# Altium schematic sheet SBG.SchDoc
size B; SheetNumber: 4; SheetTotal: 5
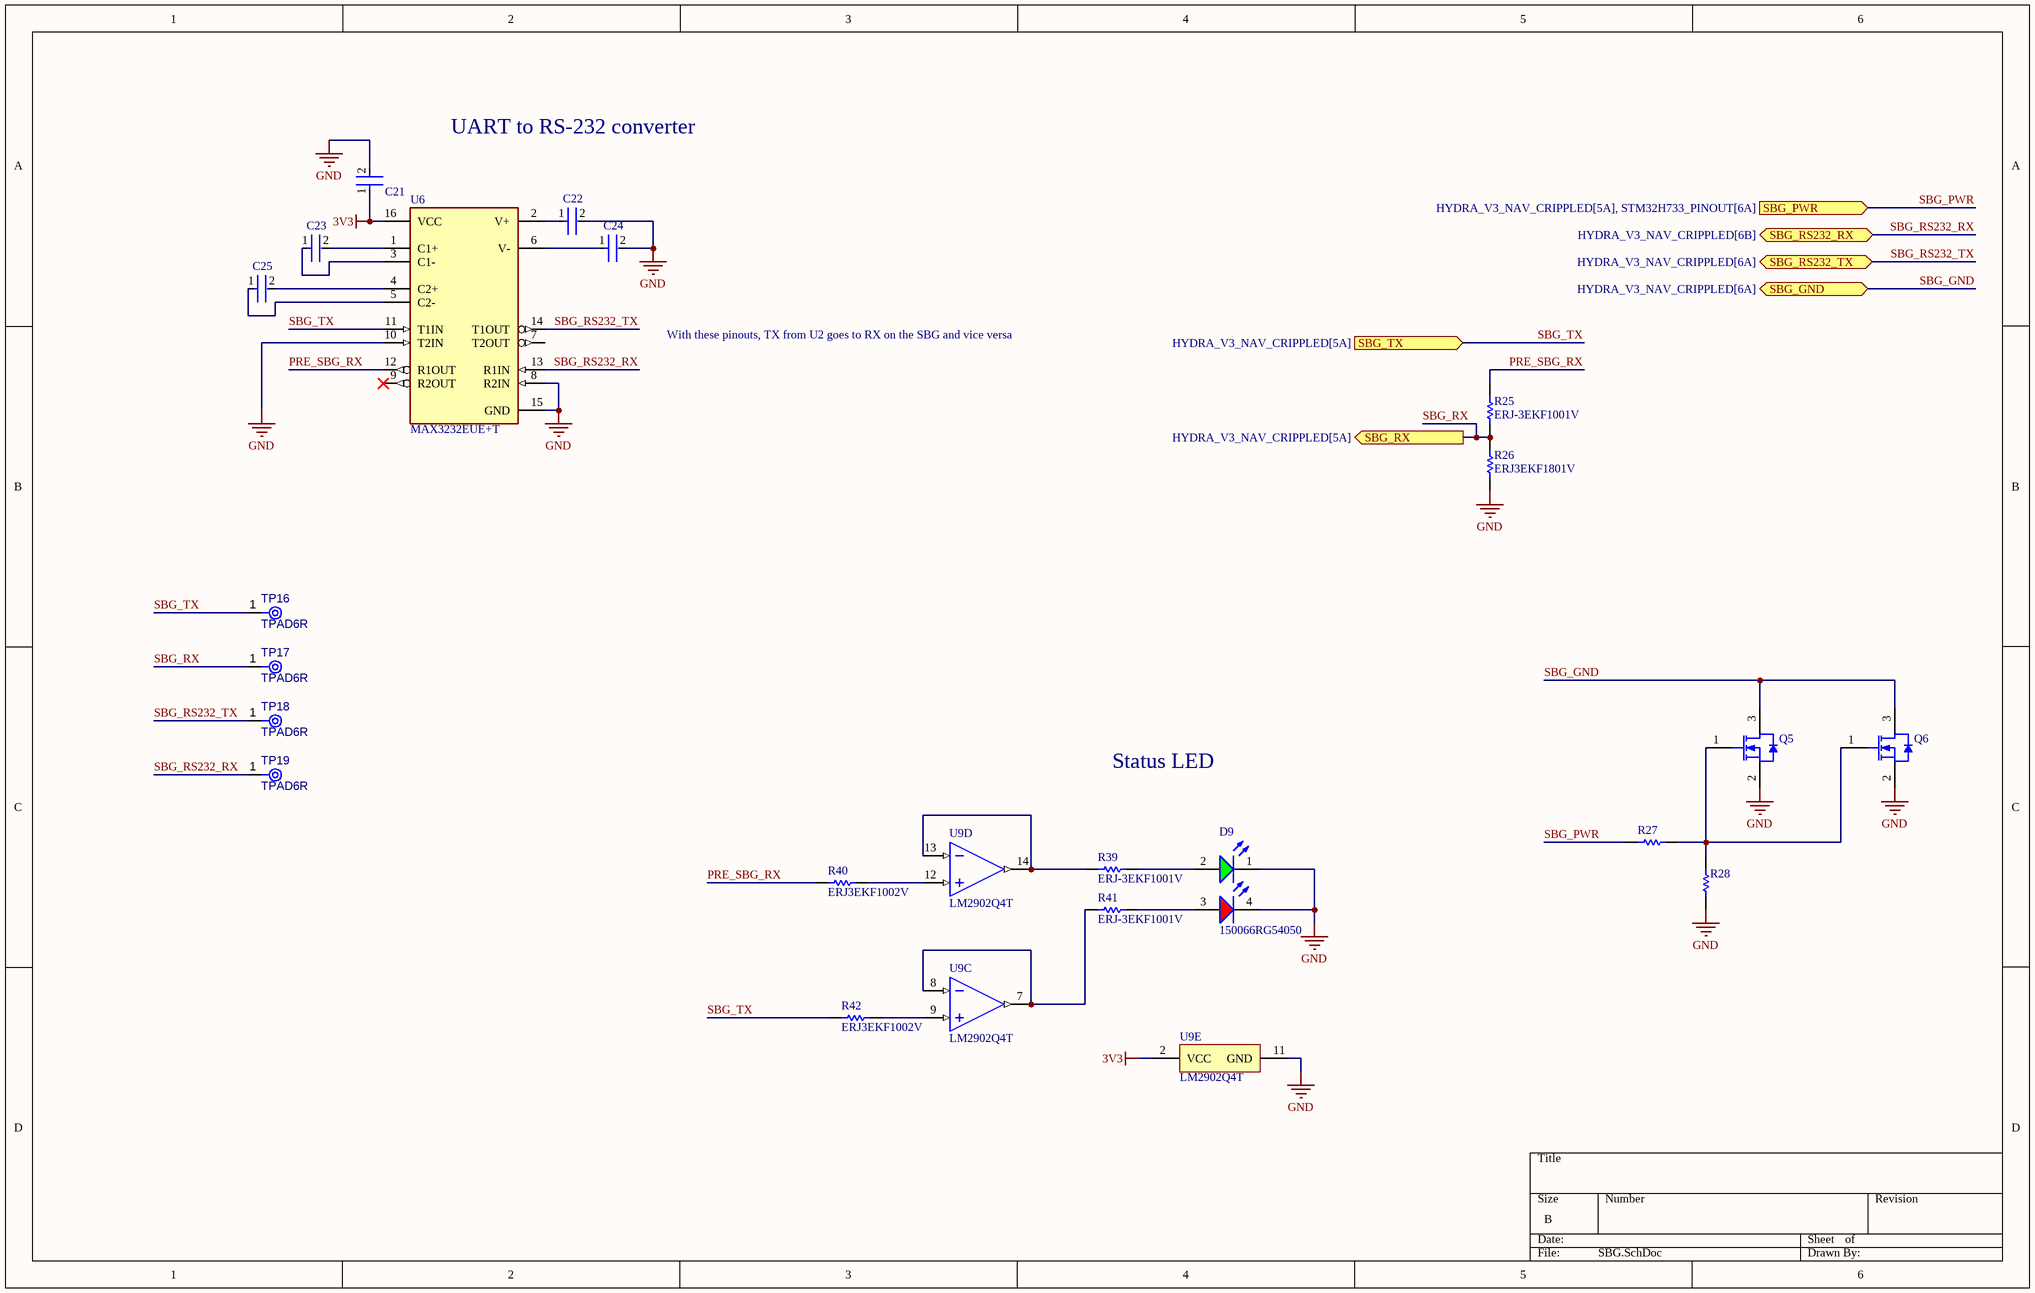
[diagram p0: SBG.SchDoc]

## Parts
C21  C0402C104K8PACTU  [FP-C0402-BB-MFG]  (value not drawn)
C22  C0603X104K5RACTU  [FP-C0603-CJ-MFG]  (value not drawn)
C23  C0603X104K5RACTU  [FP-C0603-CJ-MFG]  (value not drawn)
C24  C0603X104K5RACTU  [FP-C0603-CJ-MFG]  (value not drawn)
C25  C0603X104K5RACTU  [FP-C0603-CJ-MFG]  (value not drawn)
D9  150066RG54050  [WL-SBCD_0606]
Q5  BSS138W-7-F  [DIOD-SOT323-3_V]  (value not drawn)
Q6  BSS138W-7-F  [DIOD-SOT323-3_V]  (value not drawn)
R25  ERJ-3EKF1001V  [RESC1608X55X30LL15T15]
R26  ERJ3EKF1801V  [RESC1608X55X30LL15T15]
R27  ERJ-3EKF1001V  [RESC1608X55X30LL15T15]  (value not drawn)
R28  ERJ3EKF1002V  [RESC1609X55X30LL15T15]  (value not drawn)
R39  ERJ-3EKF1001V  [RESC1608X55X30LL15T15]
R40  ERJ3EKF1002V  [RESC1609X55X30LL15T15]
R41  ERJ-3EKF1001V  [RESC1608X55X30LL15T15]
R42  ERJ3EKF1002V  [RESC1609X55X30LL15T15]
TP16  TPAD6R  [TP06R]  (no BOM)
TP17  TPAD6R  [TP06R]  (no BOM)
TP18  TPAD6R  [TP06R]  (no BOM)
TP19  TPAD6R  [TP06R]  (no BOM)
U6  MAX3232EUE+T  [FP-U16-1-MFG]
U9  LM2902Q4T  [LM2902Q4T-Footprint-1]  (parts C,D,E of 5)

## Ports
SBG_GND (bidir, see HYDRA_V3_NAV_CRIPPLED[6A]), SBG_PWR (in, see HYDRA_V3_NAV_CRIPPLED[5A], STM32H733_PINOUT[6A]), SBG_RS232_RX (bidir, see HYDRA_V3_NAV_CRIPPLED[6B]), SBG_RS232_TX (bidir, see HYDRA_V3_NAV_CRIPPLED[6A]), SBG_RX (out, see HYDRA_V3_NAV_CRIPPLED[5A]), SBG_TX (in, see HYDRA_V3_NAV_CRIPPLED[5A])

## Nets
3V3: C21.1 U6.16(VCC) U9.2(VCC)
GND: C21.2 C22.2 C24.2 D9.1(K) D9.4(K) Q5.2(S) Q6.2(S) R26.1 R28.1 U6.8(R2IN) U6.10(T2IN) U6.15(GND) U9.11(GND)
PRE_SBG_RX: R25.2 R40.1 U6.12(R1OUT)
SBG_GND: Q5.3(D) Q6.3(D) ; port SBG_GND
SBG_PWR: R27.1 ; port SBG_PWR
SBG_RS232_RX: TP19.1(TP) U6.13(R1IN) ; port SBG_RS232_RX
SBG_RS232_TX: TP18.1(TP) U6.14(T1OUT) ; port SBG_RS232_TX
SBG_RX: R25.1 R26.2 TP17.1(TP) ; port SBG_RX
SBG_TX: R42.2 TP16.1(TP) U6.11(T1IN) ; port SBG_TX
NetC22_1: C22.1 U6.2(V+)
NetC23_1: C23.1 U6.3(C1-)
NetC23_2: C23.2 U6.1(C1+)
NetC24_1: C24.1 U6.6(V-)
NetC25_1: C25.1 U6.5(C2-)
NetC25_2: C25.2 U6.4(C2+)
NetD9_2: D9.2(A) R39.2
NetD9_3: D9.3(A) R41.2
NetQ5_1: Q5.1(G) Q6.1(G) R27.2 R28.2
NetR39_1: R39.1 U9.13(4IN-) U9.14(4OUT)
NetR40_2: R40.2 U9.12(4IN+)
NetR41_1: R41.1 U9.7(3OUT) U9.8(3IN-)
NetR42_1: R42.1 U9.9(3IN+)

Not connected (* = marked no-connect by the designer): U6 7(T2OUT) 9(R2OUT)*

## Notes on the sheet
- UART to RS-232 converter
- With these pinouts, TX from U2 goes to RX on the SBG and vice versa
- Status LED

## Library data of the parts
C21 = CMP-2008-02046-2: CAP CER 0.1UF 10V X5R 0402; Manufacturer: Kemet; Material: Ceramic; Capacitance: 0.10 μF; Temperature Coefficient: 15%; Tolerance: 0.1; Value: 0.10 μF; Package: C0402-BB; Temperature: -55°C to +125°C; ComponentLink2Description: Datasheet; Temperature Characteristic: X5R; Device Class L1: Passive Components; Height: 0.55mm; Lead Free: Yes; ComponentLink2URL: https://content.kemet.com/datasheets/KEM_C1002_X7R_SMD.pdf; Device Class L2: Capacitors; Temperature Range Low: -55°C; Temperature Range High: +125°C; RoHS: TRUE; Octopart: https://octopart.com/c0402c104k8pactu-kemet-140039; Automotive: No; Mouser Description: Capacitor 100 nF 10 VDC 0402; Category: Cap; Voltage Rating: 10 V; Digikey Description: CAP CER 0.1UF 10V X5R 0402; Ipc Land Pattern Name: CAPC10050X50; Device Class L3: Ceramic Capacitors; Manufacturer Part Number: C0402C104K8PACTU
C22-C25 = CMP-2006-03300-2: CAP CER 0.1UF 50V X7R 0603; Manufacturer: Kemet; Capacitance: 100nF; Material: Ceramic; Tolerance: 10%; Value: 100nF; Temperature Coefficient: 15%; Temperature Range High: +125°C; Temperature Range Low: -55°C; Manufacturer Part Number: C0603X104K5RACTU; Voltage: 50V; ComponentLink2Description: Datasheet; RoHS: TRUE; ComponentLink2URL: https://content.kemet.com/datasheets/KEM_C1013_X7R_FT-CAP_SMD.pdf; Device Class L3: Ceramic Capacitors; Device Class L2: Capacitors; Package: C0603-CJ; Height: 0.95mm; Device Class L1: Passive Components; Temperature Characteristic: X7R; Lead Free: Yes; Digikey Description: CAP CER 0.1UF 50V X7R 0603; Automotive: No; Mouser Description: Capacitor; Ceramic; Cap 0.1uF; Tol+10%; SMT; Flexible Termination; Vol-Rtg 50V; TR; Temperature: -55°C to +125°C; Octopart: https://octopart.com/c0603x104k5ractu-kemet-9145062; Category: Cap; Voltage Rating: 50V; Ipc Land Pattern Name: CAPC16080X80
D9 = CMP-004-00034-2: Led, Red/Grn, 180Mcd/230Mcd, 624Nm/525Nm Rohs Compliant: Yes
Q5 Q6 = CMP-2000-05968-1: N-Channel Enhancement Mode Mosfet, 50 V, 200 mA, -55 to 150 degC, 6-Pin SOT-323, RoHS, Tape and Reel; Typical Turn-Off Delay Time: 20ns; Number of Channels: 1Channel; Type: EnhancementModeFieldEffectTransistor; Brand: DiodesIncorporated; Vds - Drain-Source Breakdown Voltage: 75V; Vgs - Gate-Source Voltage: 20V; Rds On - Drain-Source Resistance: 1.4Ohms; Transistor Type: 1N-Channel; Configuration: Single; Unit Weight: 0.000212oz; Pd - Power Dissipation: 200mW; Id - Continuous Drain Current: 200mA; Forward Transconductance - Min: 0.1S; Manufacturer URL: http://www.diodes.com/; Series: BSS138; Package Description: 3-Pin Small Outline Transistor, Body 2 x 1.25 mm, Pitch 0.65 mm; Mounting Technology: SurfaceMount; Product Category: MOSFET; RoHS: True; Maximum Operating Temperature: +150C; Height: 1mm; Length: 2.2mm; Technology: Si; Width: 1.35mm; Datasheet URL: http://www.diodes.com/_files/datasheets/ds30206.pdf; Manufacturer: DiodesIncorporated; Package / Case: SOT-323-3; Typical Turn-On Delay Time: 20ns; Transistor Polarity: N-Channel; Factory Pack Quantity: 3000; Packaging: Reel; Product: MOSFETSmallSignal; Datasheet Version: Rev. 11-2, 09/2013; Package Reference: SOT323; Minimum Operating Temperature: -55C; Mounting Style: SMD/SMT; Channel Mode: Enhancement
R25 R27 R39 R41 = CMP-2000-00180-1: Manufacturer: Panasonic; Part Number: ERJ-3EKF1001V
R26 = CMP-2000-00294-1: Manufacturer: Panasonic; Part Number: ERJ3EKF1801V
R28 R40 R42 = CMP-1012-00623-3: Chip Resistor, 10 KOhm, +/- 1%, 0.1 W, -55 to 155 degC, 0603 (1608 Metric), RoHS, Tape and Reel; Manufacturer: Panasonic; Voltage Rating: 75V; Case\/Package: 0603; Power Rating: 100mW; Resistance: 10KOhm; Temperature Coefficient: 100ppm\/degreesC; Number of Pins: 2; Package Reference: 603; Depth: 0.8mm; Mount: SurfaceMount; Package Description: 2-Pin Surface Mount Device, Body 1.6 x 0.85 mm; Datasheet Version: 02/2017; Length: 1.6mm; Lead Free: LeadFree; Height: 0.45mm; Number of Terminations: 2; Max Power Dissipation: 100mW; Min Operating Temperature: -55degC; Datasheet URL: https://industrial.panasonic.com/cdbs/www-data/pdf/RDA0000/AOA0000C304.pdf; Termination: SMD/SMT; Case Code (Metric): 1608; Case Code (Imperial): 0603; Tolerance: 1%; Max Operating Temperature: 155degC; RoHSCompliant: true; Voltage Rating (DC): 75V; Radiation Hardening: No; Packaging: TapeandReel; Composition: ThickFilm; Mounting Technology: SurfaceMount; Manufacturer URL: http://www.panasonic.com/; Width: 0.031inch; REACH SVHC: NoSVHC; Contact Plating: Tin; Military Standard: Not; Package Quantity: 1
TP16-TP19 = CMP-00028-00002-2: 0.6mm round; Pins: 1
U6 = CMP-05679-000039-1: IC TXRX RS-232 LP 16-TSSOP; Manufacturer: Maxim Integrated; Standoff Height: 0.05mm; Nominal Supply Current: 0.3mA; Simplex Duplex: Full Duplex; Max Supply Voltage: 5.5V; Data Rate: 120kbits/s; Min Supply Voltage: 3V; Number Of Receivers: 2; RoHS: TRUE; Mouser Description: MAX3232 Series 235 kbps 5.5V Surface Mount RS-232 Transceiver - TSSOP-16; Category: IC; Manufacturer Part Number: MAX3232EUE+T; Footprint Url: https://pdfserv.maximintegrated.com/land_patterns/90-0117.PDF; Device Class L2: Interface ICs; Automotive: No; ComponentLink2Description: Datasheet; Device Class L3: RS-232 / RS-422 / RS-485 Interface ICs; Temperature Range High: +85°C; Package: U16-1; Lead Free: Yes; Digikey Description: IC TXRX RS-232 LP 16-TSSOP; ComponentLink2URL: https://datasheets.maximintegrated.com/en/ds/MAX3222-MAX3241.pdf; Temperature: -40°C to +85°C; Number Of Transmitters: 2; Height: 1.1mm; Octopart: https://octopart.com/max3232eue%2Bt-maxim+integrated-39814427; Device Class L1: Integrated Circuits (ICs); Interface: RS-232; Temperature Range Low: -40°C
U9 = CMP-014-00004-1: LM2902 Series 30 V 1.3 MHz Low-Power Quad Operational Amplifier - QFN-16 (3x3)